# EAGLE design -ZPanel (EAGLE 9.5.1)
DESIGNER: Joshua Lungstrom; PART_NUMBER: 68-0012; PROJECT: CougSat-1: -Z Panel; REV: 1.1.1

## Sheet 1 of 3
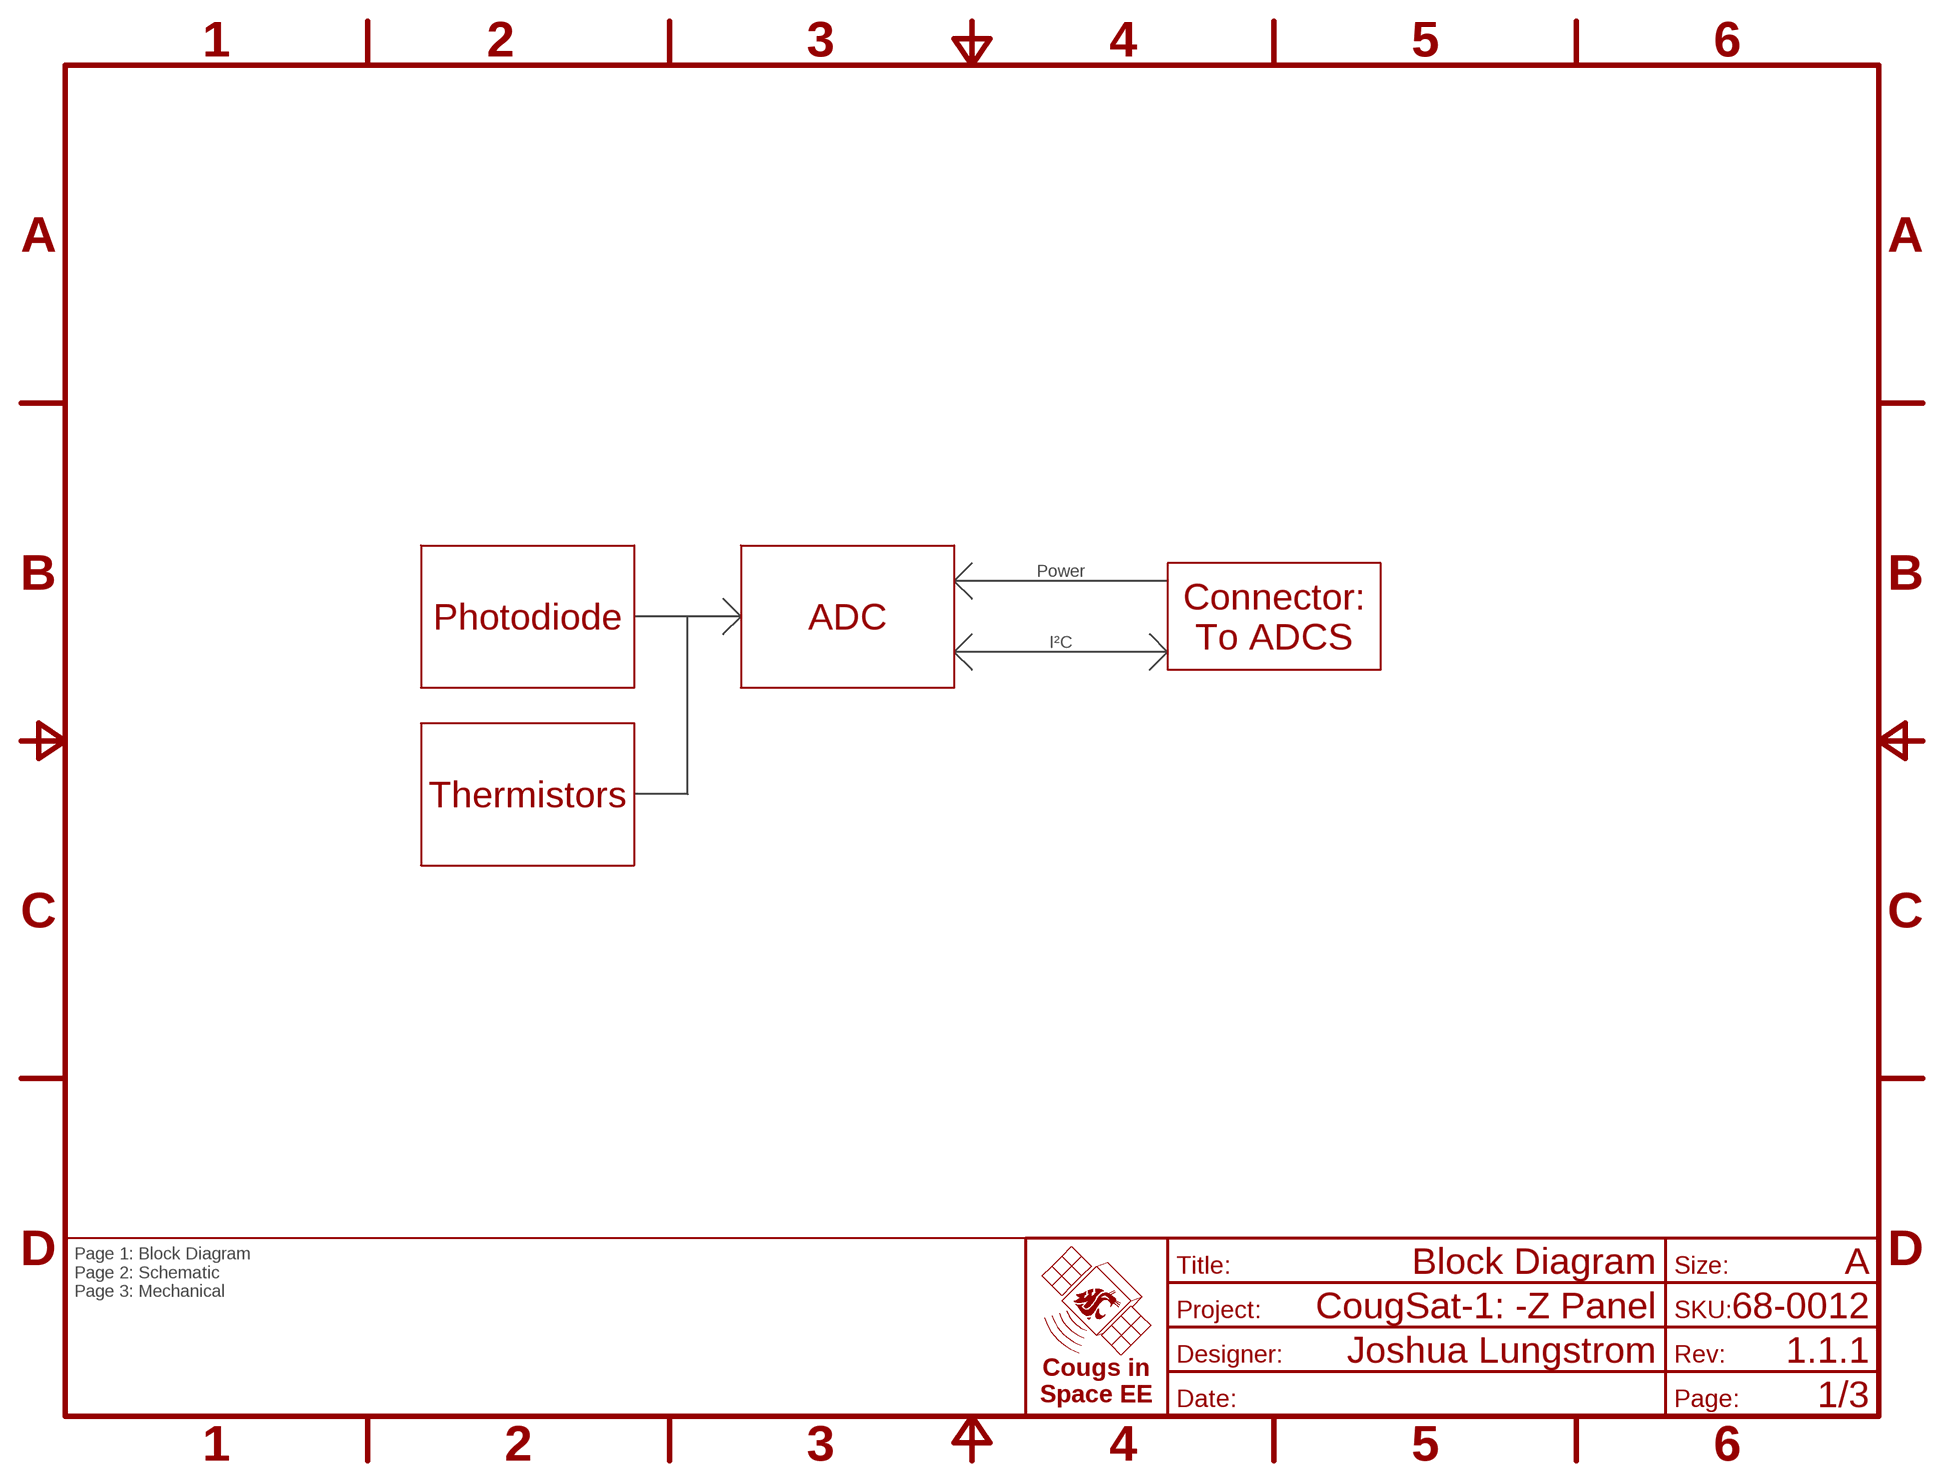
[diagram p0: schematic, sheet 1]
FRAME1 (FRAME-A): TITLE: Block Diagram

### Notes on the sheet
- Power
- Photodiode | ADC
- Connector:
  To ADCS
- I²C
- Thermistors
- Page 1: Block Diagram
  Page 2: Schematic
  Page 3: Mechanical

## Sheet 2 of 3
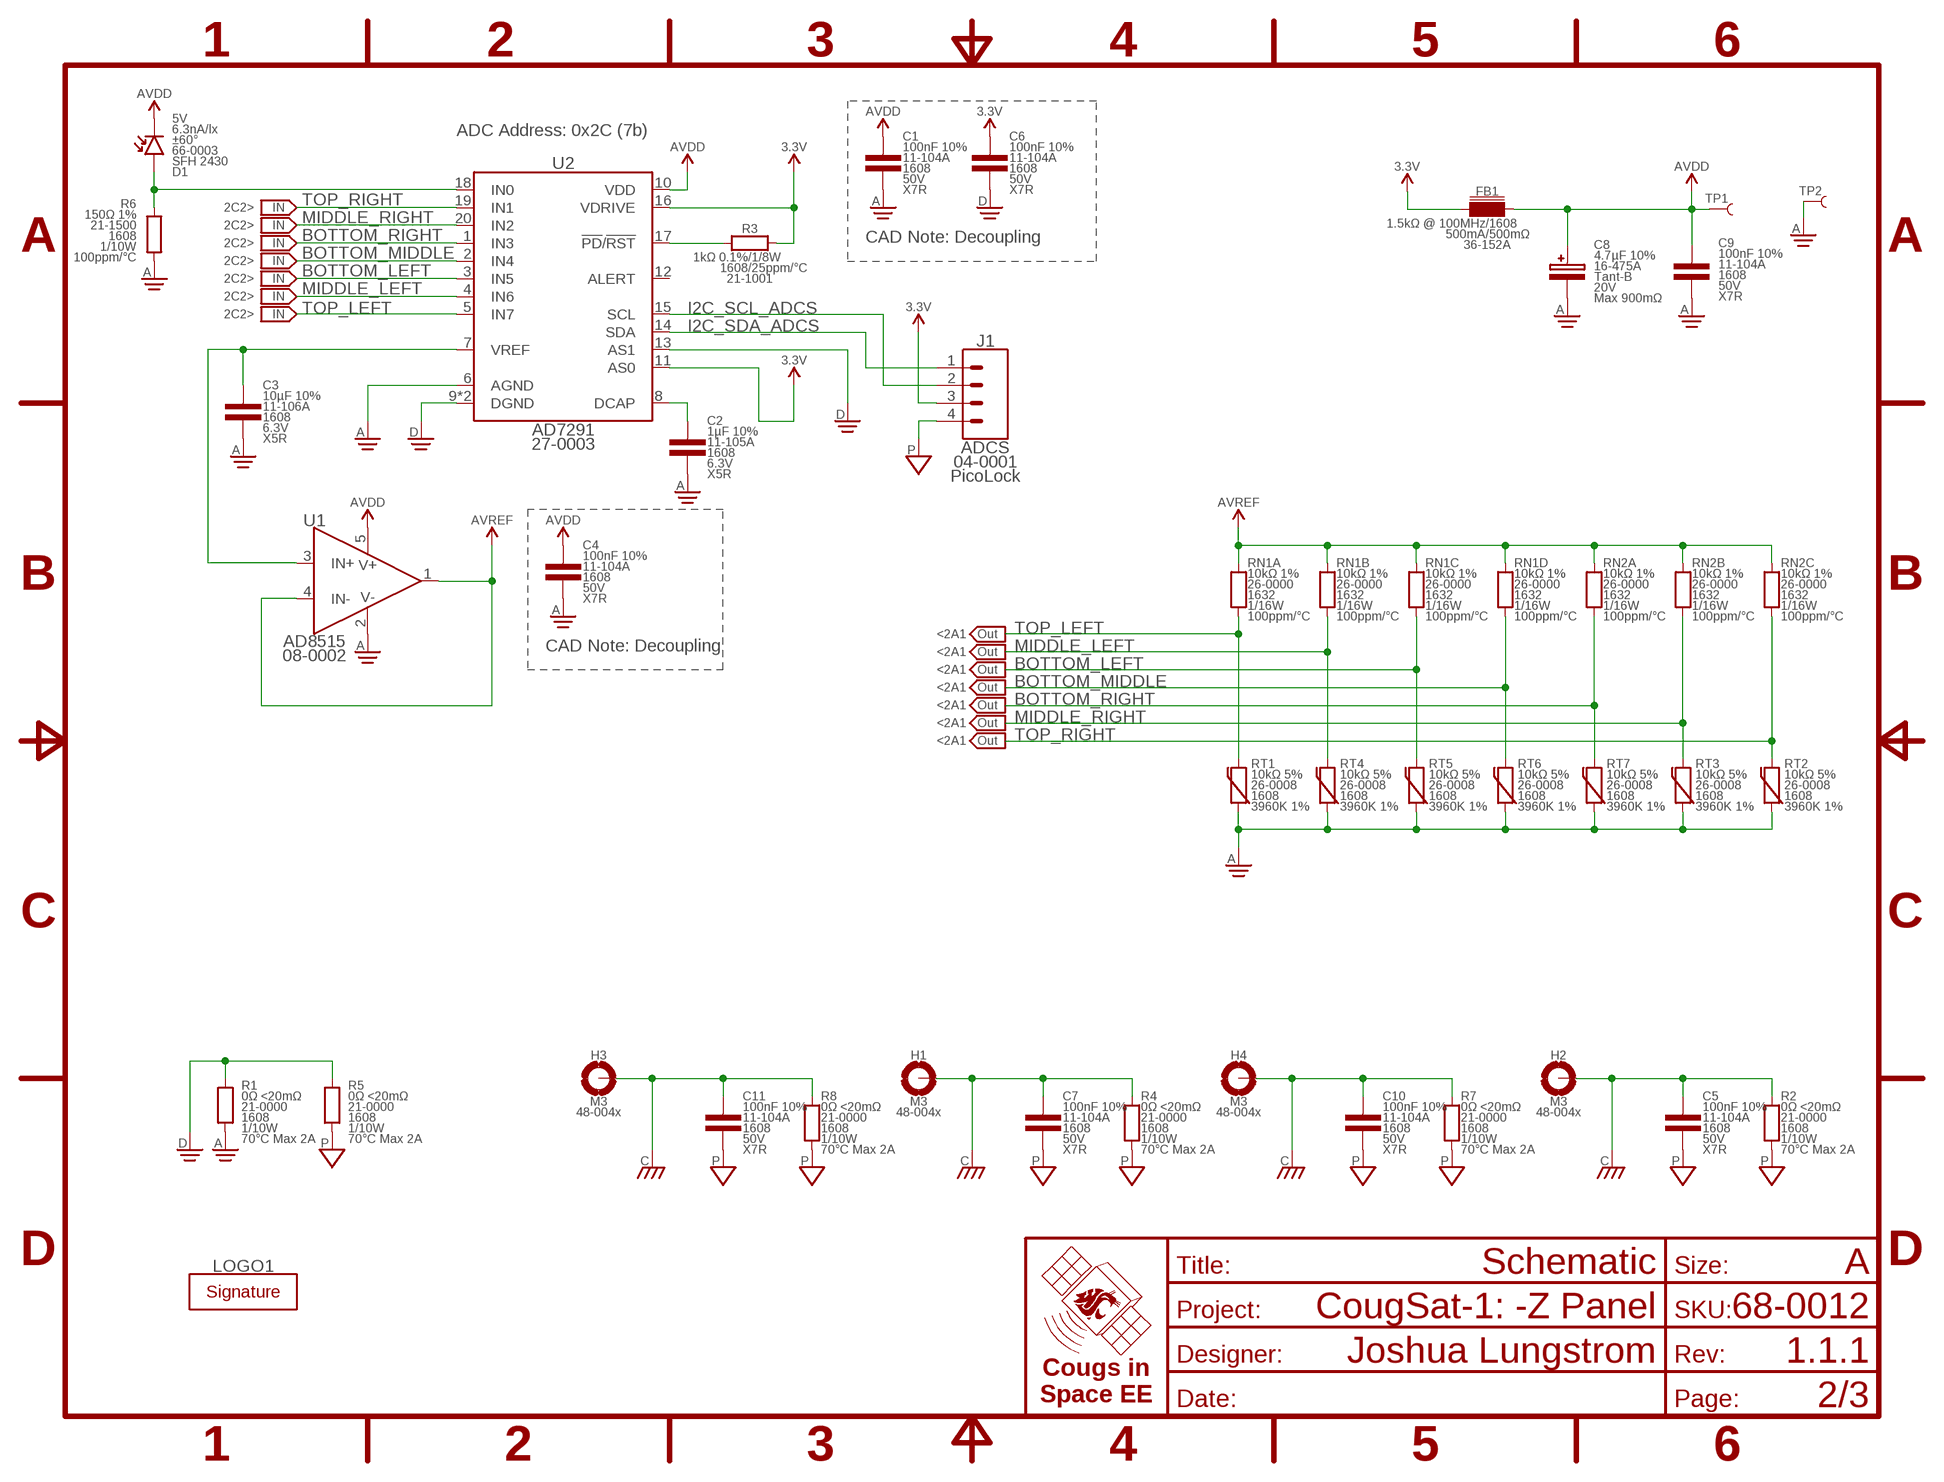
[diagram p1: schematic, sheet 2]
FRAME2 (FRAME-A): TITLE: Schematic

### Parts
C1  100nF 10%  CAP-V-100NF-1608  [1608]
C2  1µF 10%  CAP-V-1UF-1608  [1608]
C3  10µF 10%  CAP-V-10UF-1608  [1608]
C4  100nF 10%  CAP-V-100NF-1608  [1608]
C5  100nF 10%  CAP-V-100NF-1608  [1608]
C6  100nF 10%  CAP-V-100NF-1608  [1608]
C7  100nF 10%  CAP-V-100NF-1608  [1608]
C8  4.7µF 10%  CAP-POL-V-4.7UF-4028  [4028-POL]
C9  100nF 10%  CAP-V-100NF-1608  [1608]
C10  100nF 10%  CAP-V-100NF-1608  [1608]
C11  100nF 10%  CAP-V-100NF-1608  [1608]
D1  SFH 2430  PHOTODIODE-SFH2430  [SFH2430]
FB1  1.5kΩ @ 100MHz  CHOKE-H-1.5K-1608  [1608]
H1  M3  MOUNTING_HOLE-3.3  [MOUNTING_HOLE-3.3]
H2  M3  MOUNTING_HOLE-3.3  [MOUNTING_HOLE-3.3]
H3  M3  MOUNTING_HOLE-3.3  [MOUNTING_HOLE-3.3]
H4  M3  MOUNTING_HOLE-3.3  [MOUNTING_HOLE-3.3]
J1  ADCS  1X04-PICOLOCK  [PICOLOCK1.5-04]
LOGO1  SIGNATUREJOSH  [SIGN-JOSH]
R1  0Ω <20mΩ  RES-V-0-1608  [1608]
R2  0Ω <20mΩ  RES-V-0-1608  [1608]
R3  1kΩ 0.1%  RES-H-1K-1608  [1608]
R4  0Ω <20mΩ  RES-V-0-1608  [1608]
R5  0Ω <20mΩ  RES-V-0-1608  [1608]
R6  150Ω 1%  RES-V-150R-1608  [1608]
R7  0Ω <20mΩ  RES-V-0-1608  [1608]
R8  0Ω <20mΩ  RES-V-0-1608  [1608]
RN1  10kΩ 1%  RES-4-V-10K-1632  [1632]
RN2  10kΩ 1%  RES-4-V-10K-1632  [1632]
RT1  10kΩ 5%  THERMISTOR-V-10K-1608  [1608]
RT2  10kΩ 5%  THERMISTOR-V-10K-1608  [1608]
RT3  10kΩ 5%  THERMISTOR-V-10K-1608  [1608]
RT4  10kΩ 5%  THERMISTOR-V-10K-1608  [1608]
RT5  10kΩ 5%  THERMISTOR-V-10K-1608  [1608]
RT6  10kΩ 5%  THERMISTOR-V-10K-1608  [1608]
RT7  10kΩ 5%  THERMISTOR-V-10K-1608  [1608]
TP1  TEST_POINT-THT-0.7  [THT-0.7]
TP2  TEST_POINT-THT-0.7  [THT-0.7]
U1  AD8515  OPAMP-1-AD8515  [SOT23-5]
U2  AD7291  [QFN-20-4040]

### Nets
3.3V: C6.1 FB1.1 J1.3 R3.2 U2.11(AS0) U2.16(VDRIVE)
AGND: C1.2 C2.2 C3.2 C4.2 C8.C C9.2 R1.1 R6.1 RT1.1 RT2.1 RT3.1 RT4.1 RT5.1 RT6.1 RT7.1 TP2.1 U1.2(V-) U2.6(AGND)
AVDD: C1.1 C4.1 C8.A C9.1 D1.C FB1.2 TP1.1 U1.5(V+) U2.10(VDD)
AVREF: RN1.5 RN1.6 RN1.7 RN1.8 RN2.6 RN2.7 RN2.8 U1.1(OUT) U1.4(IN-)
BOTTOM_LEFT: RN1.3 RT5.2 U2.3(IN5)
BOTTOM_MIDDLE: RN1.4 RT6.2 U2.2(IN4)
BOTTOM_RIGHT: RN2.1 RT7.2 U2.1(IN3)
CHASSIS: C5.1 C7.1 C10.1 C11.1 H1.1(MOUNT) H1.V1(MOUNT) H1.V2(MOUNT) H1.V3(MOUNT) H1.V4(MOUNT) H1.V5(MOUNT) H1.V6(MOUNT) H1.V7(MOUNT) H1.V8(MOUNT) H1.V9(MOUNT) H1.V10(MOUNT) H2.1(MOUNT) H2.V1(MOUNT) H2.V2(MOUNT) H2.V3(MOUNT) H2.V4(MOUNT) H2.V5(MOUNT) H2.V6(MOUNT) H2.V7(MOUNT) H2.V8(MOUNT) H2.V9(MOUNT) H2.V10(MOUNT) H3.1(MOUNT) H3.V1(MOUNT) H3.V2(MOUNT) H3.V3(MOUNT) H3.V4(MOUNT) H3.V5(MOUNT) H3.V6(MOUNT) H3.V7(MOUNT) H3.V8(MOUNT) H3.V9(MOUNT) H3.V10(MOUNT) H4.1(MOUNT) H4.V1(MOUNT) H4.V2(MOUNT) H4.V3(MOUNT) H4.V4(MOUNT) H4.V5(MOUNT) H4.V6(MOUNT) H4.V7(MOUNT) H4.V8(MOUNT) H4.V9(MOUNT) H4.V10(MOUNT) R2.2 R4.2 R7.2 R8.2
DCAP: C2.1 U2.8(DCAP)
DGND: C6.2 R1.2 R5.2 U2.9(DGND) U2.13(AS1) U2.PAD(DGND)
I2C_SCL_ADCS: J1.2 U2.15(SCL)
I2C_SDA_ADCS: J1.1 U2.14(SDA)
MIDDLE_LEFT: RN1.2 RT4.2 U2.4(IN6)
MIDDLE_RIGHT: RN2.2 RT3.2 U2.20(IN2)
PD/RST: R3.1 U2.17(!PD!/!RST)
PGND: C5.2 C7.2 C10.2 C11.2 J1.4 R2.1 R4.1 R5.1 R7.1 R8.1
PHOTODIODE_ADC: D1.A R6.2 U2.18(IN0)
TOP_LEFT: RN1.1 RT1.2 U2.5(IN7)
TOP_RIGHT: RN2.3 RT2.2 U2.19(IN1)
VREF: C3.1 U1.3(IN+) U2.7(VREF)
Unconnected: RN2.4 RN2.5 U2.12(ALERT)

### Notes on the sheet
- ADC Address: 0x2C (7b)
- 2C2>
- 2C2>
- 2C2> | CAD Note: Decoupling
- 2C2>
- 2C2>
- 2C2>
- 2C2>
- <2A1
- CAD Note: Decoupling | <2A1
- <2A1
- <2A1
- <2A1
- <2A1
- <2A1

## Sheet 3 of 3
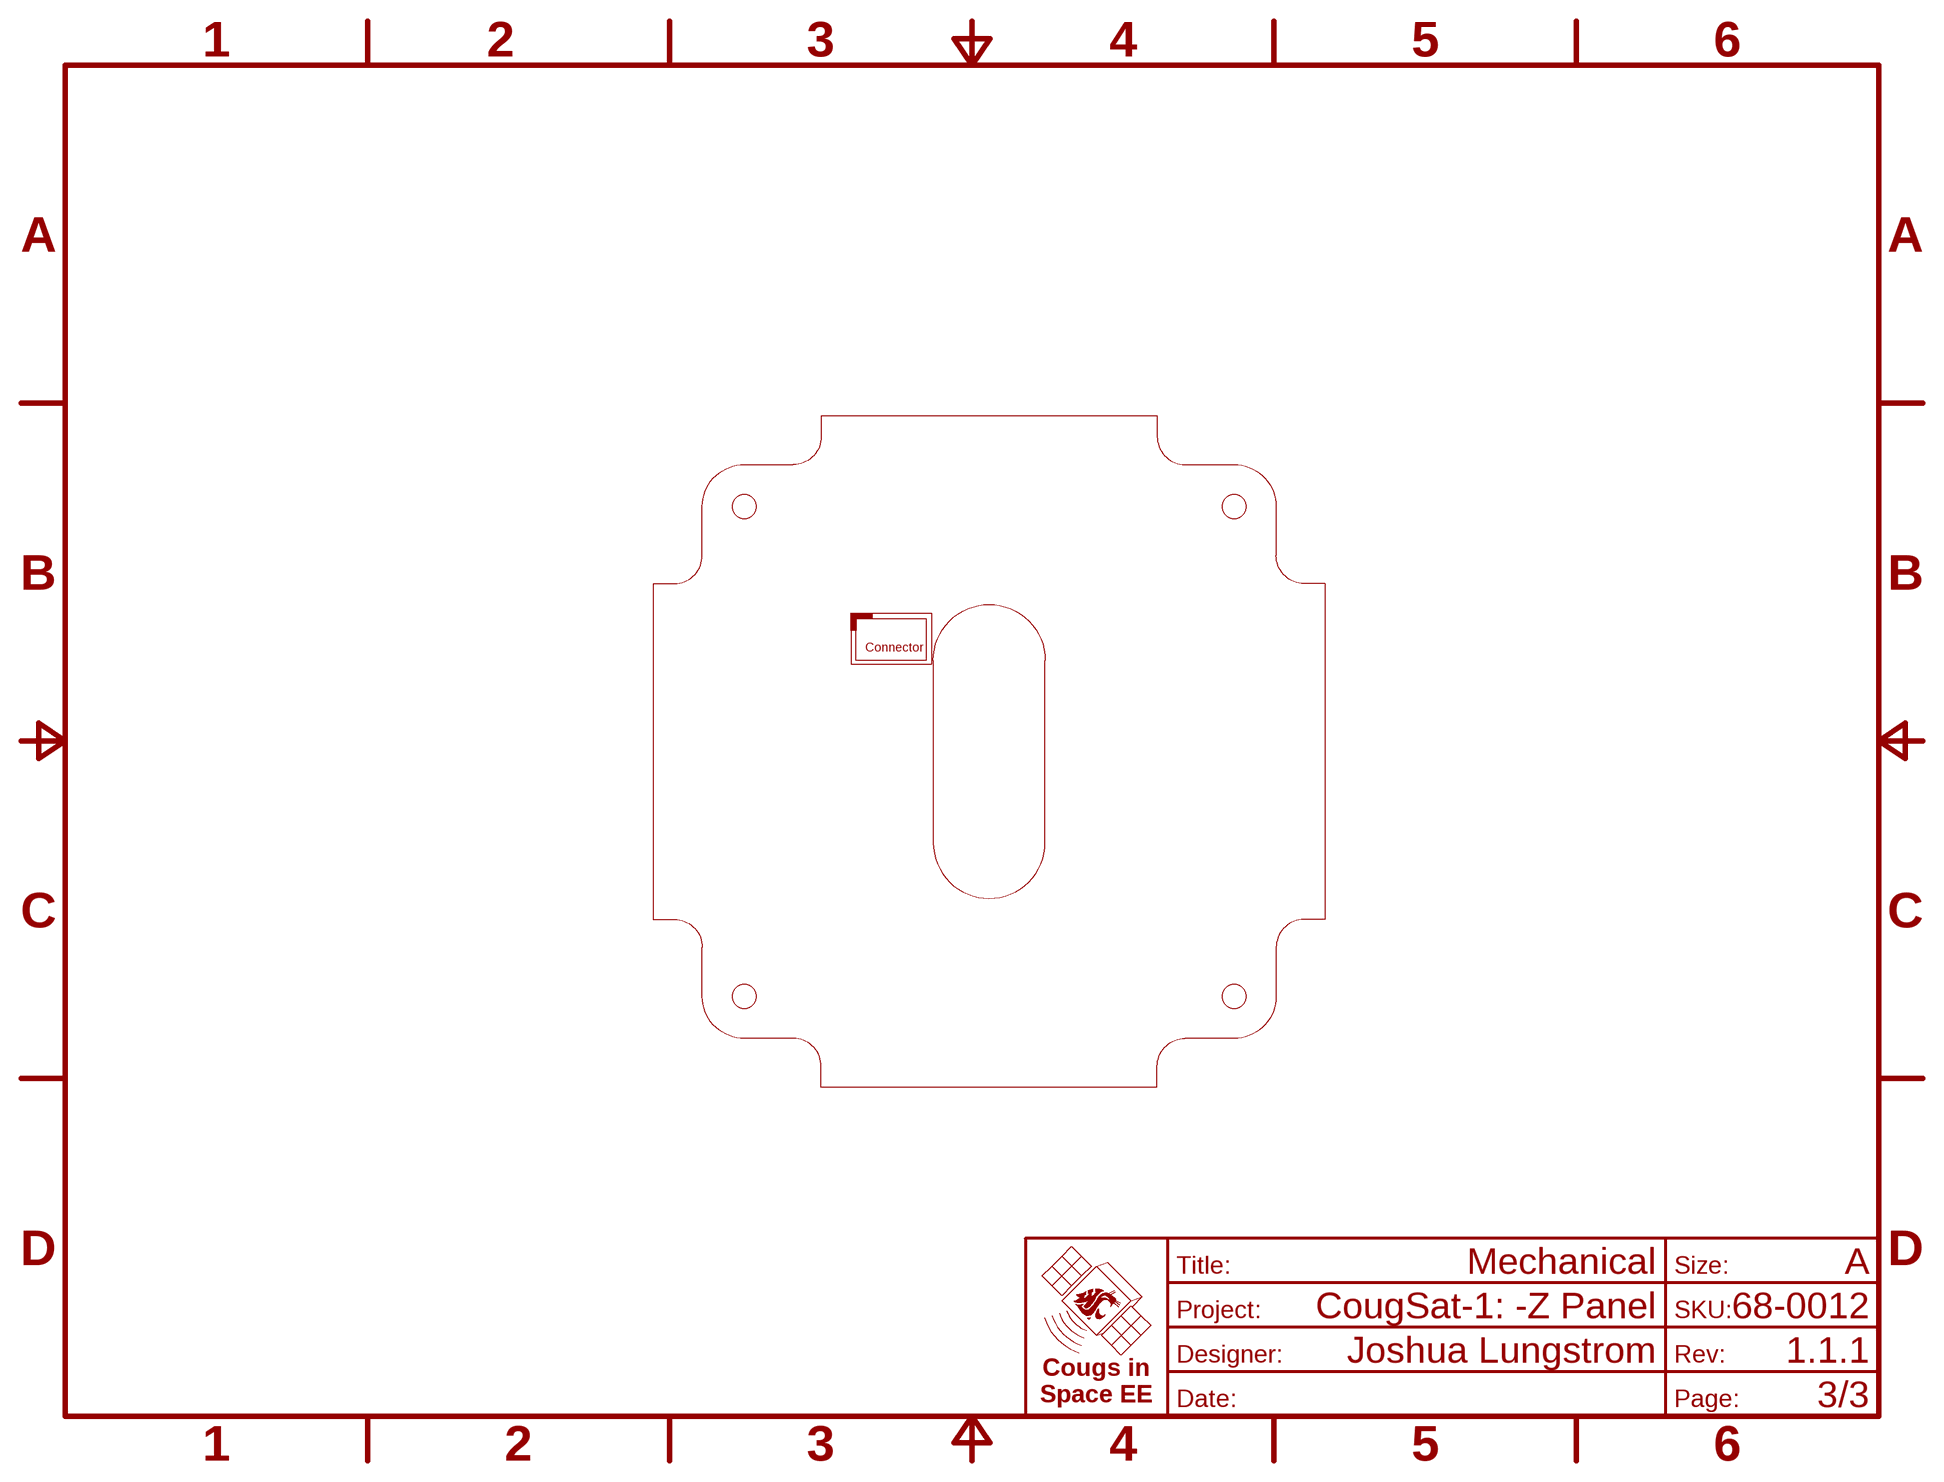
[diagram p2: schematic, sheet 3]
FRAME3 (FRAME-A): TITLE: Mechanical

### Notes on the sheet
- Connector

## Library data of the parts
C1 C4-C7 C9-C11 = CougsInSpace-Capacitors:CAP-V: Capacitor - Vertical Orientation; PACKAGE: 1608; SKU: 11-104A; TEMP: X7R; VOLTAGE: 50V
C2 = CougsInSpace-Capacitors:CAP-V: Capacitor - Vertical Orientation; PACKAGE: 1608; SKU: 11-105A; TEMP: X5R; VOLTAGE: 6.3V
C3 = CougsInSpace-Capacitors:CAP-V: Capacitor - Vertical Orientation; PACKAGE: 1608; SKU: 11-106A; TEMP: X5R; VOLTAGE: 6.3V
C8 = CougsInSpace-Capacitors:CAP-POL-V: Capacitor Polarized - Vertical Orientation; ESR: Max 900mΩ; PACKAGE: Tant-B; SKU: 16-475A; VOLTAGE: 20V
D1 = CougsInSpace-Sensors:PHOTODIODE: Photodiode; HALF_ANGLE: ±60°; SENSITIVITY: 6.3nA/lx; SKU: 66-0003; VR: 5V
FB1 = CougsInSpace-Coils:CHOKE-H: Choke (Ferrite Bead) Horizontal; CURRENT: 500mA; DCR: 500mΩ; PACKAGE: 1608; SKU: 36-152A
H1-H4 = CougsInSpace-Hardware:MOUNTING_HOLE: Mounting Hole; SKU: 48-004x
J1 = CougsInSpace-Connectors:1X04: Generic Connector - 4 Conductor; PACKAGE: PicoLock; SKU: 04-0001
LOGO1 = CougsInSpace-Aesthetics:SIGNATURE: Designer's (Artist's) Signature
R1 R2 R4 R5 R7 R8 = CougsInSpace-Resistors:RES-V: Resistor Vertical; PACKAGE: 1608; POWER: 1/10W; SKU: 21-0000; TEMP: 70°C Max 2A
R3 = CougsInSpace-Resistors:RES-H: Resistor Horizontal; PACKAGE: 1608; POWER: 1/8W; SKU: 21-1001; TEMP: 25ppm/°C
R6 = CougsInSpace-Resistors:RES-V: Resistor Vertical; PACKAGE: 1608; POWER: 1/10W; SKU: 21-1500; TEMP: 100ppm/°C
RN1 RN2 = CougsInSpace-Resistors:RES-4-V: Resistor Array - 4 - Vertical; PACKAGE: 1632; POWER: 1/16W; SKU: 26-0000; TEMP: 100ppm/°C
RT1-RT7 = CougsInSpace-Resistors:THERMISTOR-V: Thermistor Vertical; B2585: 3960K 1%; PACKAGE: 1608; SKU: 26-0008
TP1 TP2 = CougsInSpace-Connectors:TEST_POINT: Test Point Used to probe points in a circuit for debugging or general measurement
U1 = CougsInSpace-IC-Amplifiers:OPAMP-1: Operational Amplifier - Single; SKU: 08-0002
U2 = CougsInSpace-IC-Conversion:AD7291: AD7291 12b ADC with 8-single ended channels. I²C interface; SKU: 27-0003

## Net classes
1 RF: clearance 1.65 mm

## Board
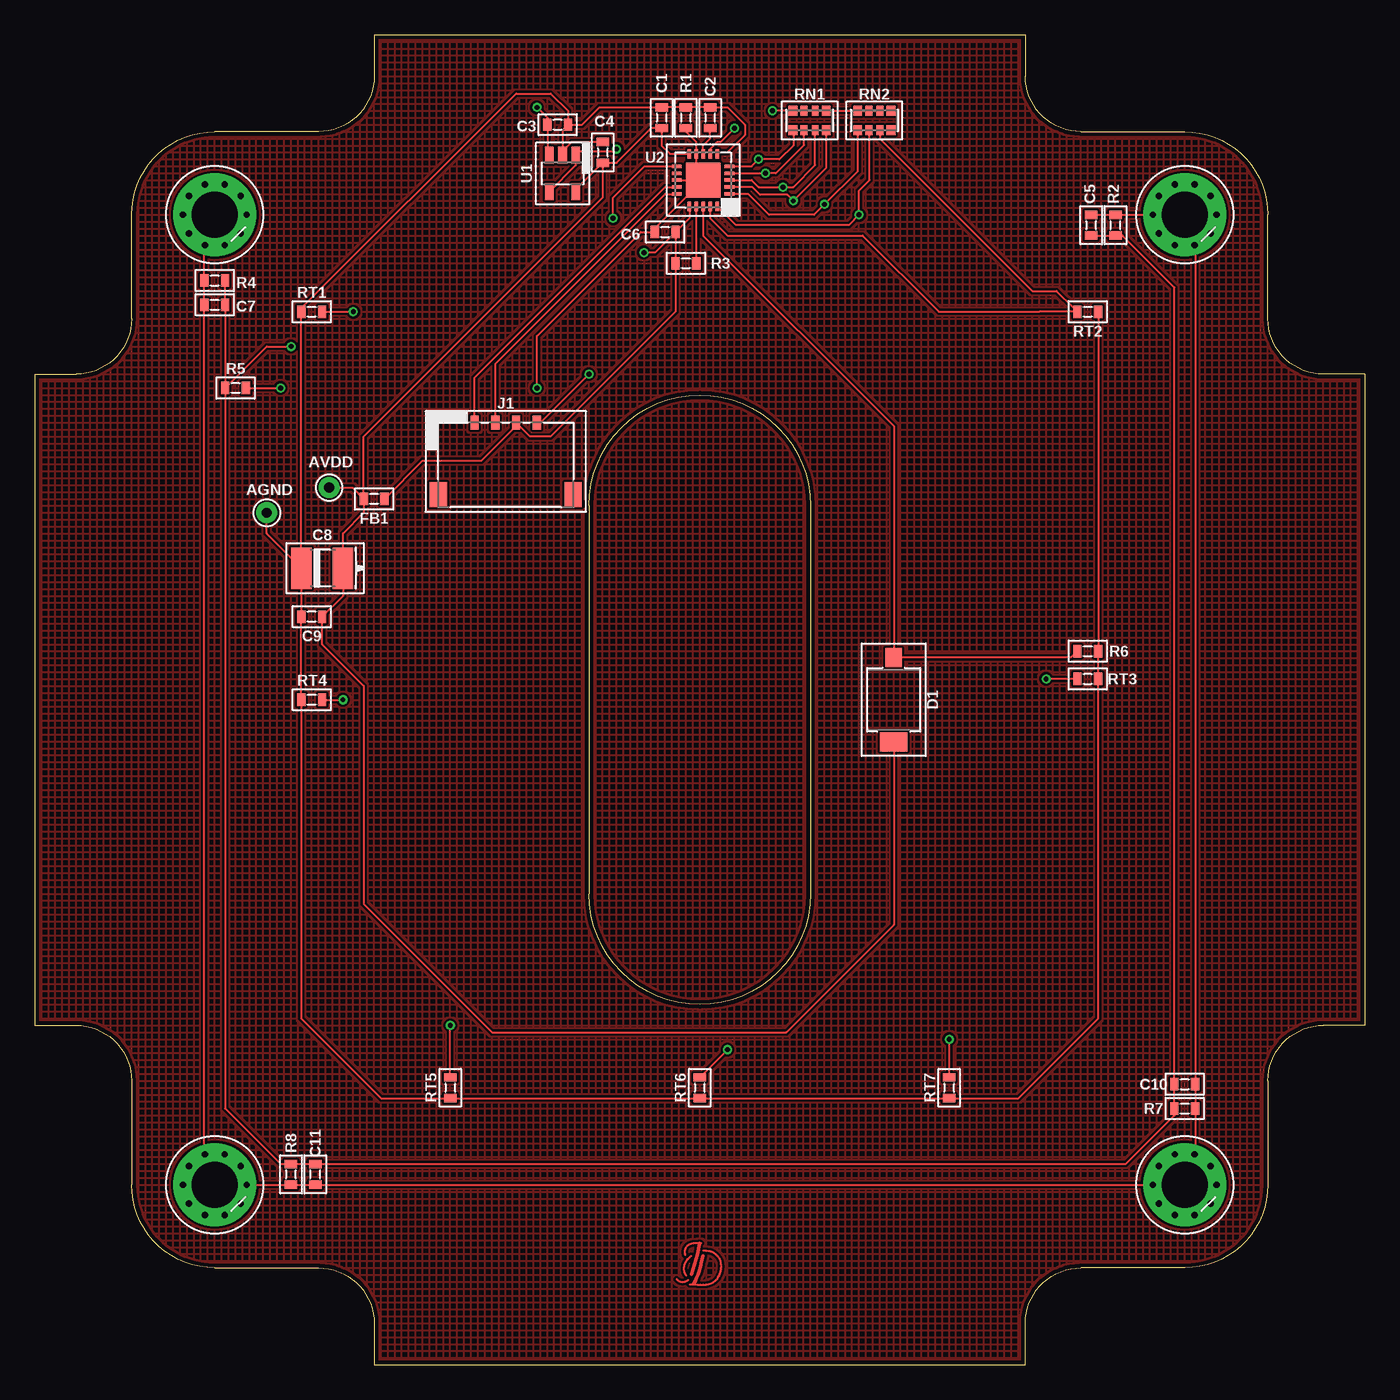
[diagram p3: board, top side]
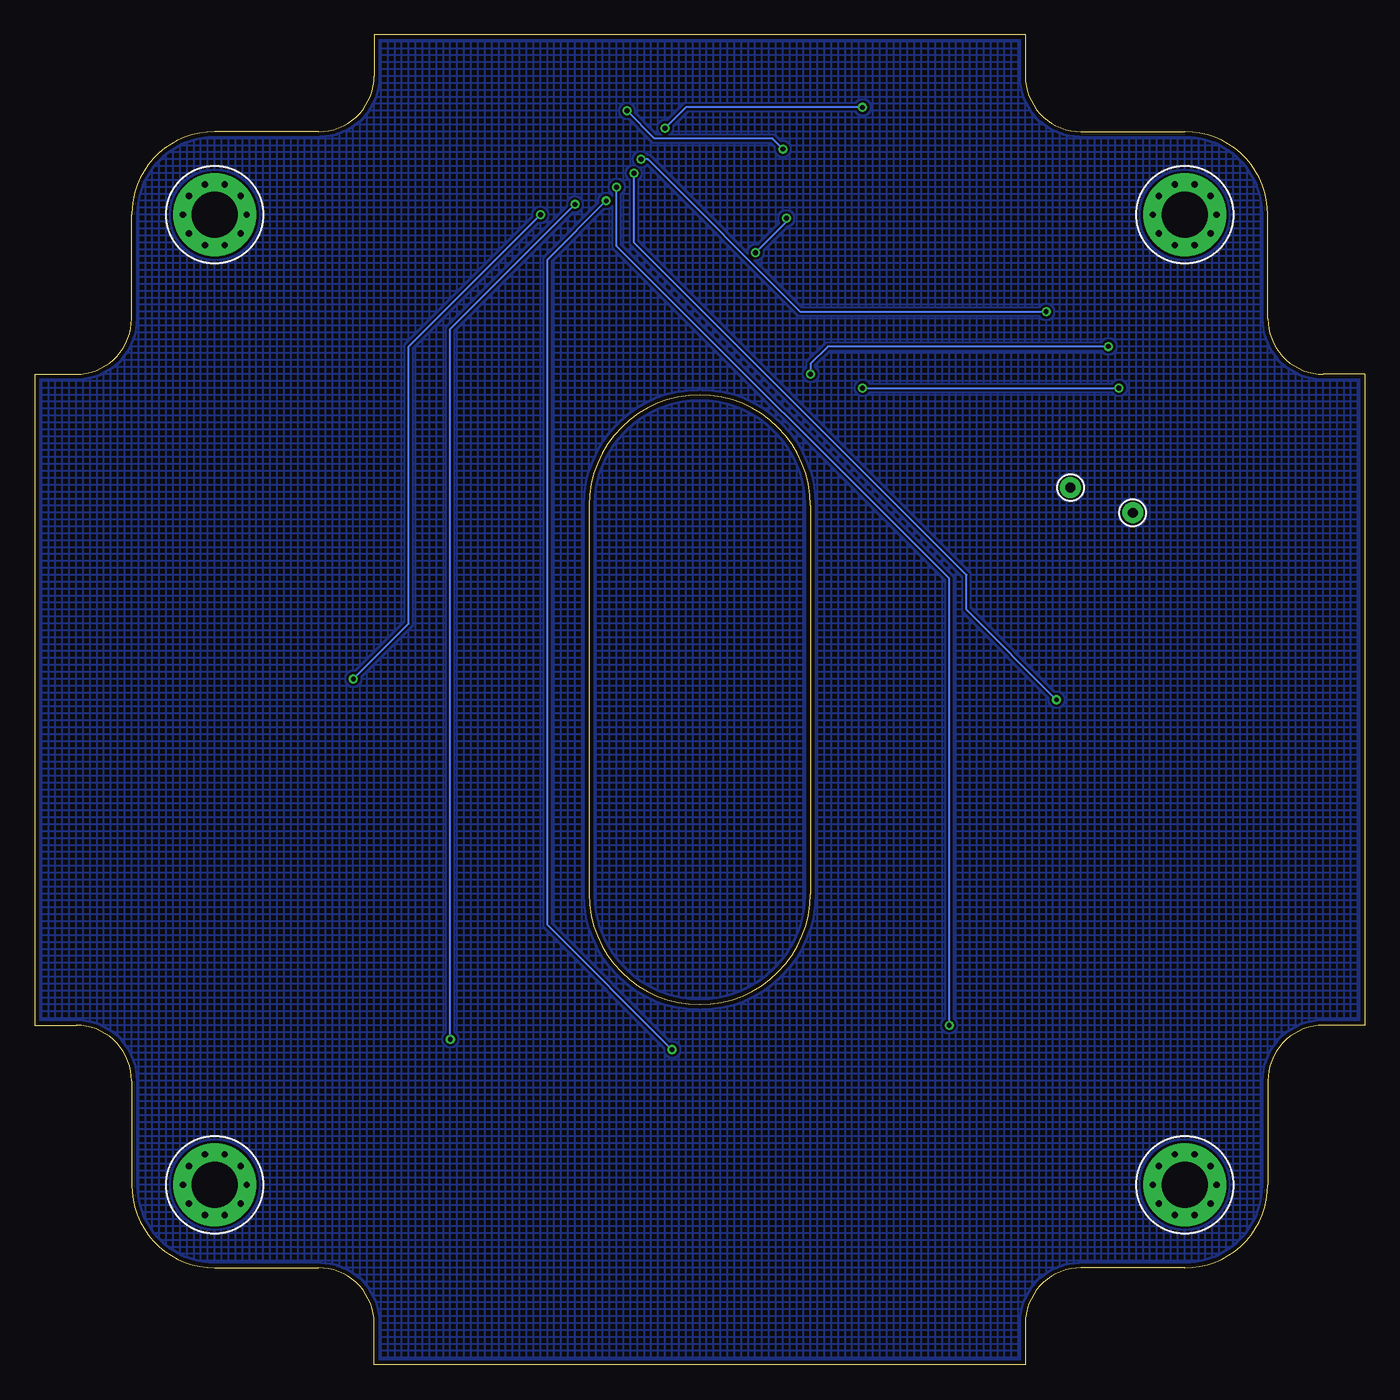
[diagram p4: board, bottom side, seen from below]

Size 96 x 96 mm. Coordinates in mm from the lower left corner, seen from the top.
Outline: 24.5,0 24.75,0
Outline: 24.75,0 71.5,0 71.5,3 arc-90 75.5,7 83,7 arc90 89,13 89,20.5 arc-90 93,24.5 96,24.5 96,71.5 93,71.5 arc-90 89,75.5 89,83 arc90 83,89 75.5,89 arc-90 71.5,93 71.5,96 24.5,96 24.5,93 arc-90 20.5,89 13,89 arc90 7,83 7,75.5 arc-90 3,71.5 0,71.5 0,24.5 3,24.5 arc-90 7,20.5 7,13 arc90 13,7 20.5,7 arc-90 24.5,3 24.5,0
Outline: 24.5,0 24.75,0
Outline: 56,62 56,34 arc-180 40,34 40,62 arc-180 56,62
Copper layers (1*16): Top 0.035mm / dielectric 1.6mm / Bottom 0.035mm
Design rules "CougsInSpace": minimum track width 0.16mm, minimum drill 0.3mm, track to track 0.16mm, track to pad 0.16mm, pad to pad 0.16mm, via to via 0.16mm, smd to smd 0mil, copper to edge 0.3mm, drill to drill 0.3mm, minimum pad ring 0.15mm, minimum via ring 0.15mm, stop-mask expansion 0mil, vias tented up to drill 1mm, thermal gap 0.25mm

### Footprints (pad centres in the part's own frame; a part is rotated, then mirrored left to right if it is on the bottom)
1608 = smd 0.6 x 0.9: 1 -0.75,0; 2 0.75,0
4028-POL = smd 1.5 x 3: A 1.5,0; C -1.5,0
SFH2430 = smd 1.4 x 1.2: A -3.05,0 | smd 1.4 x 2: C 3.05,0
MOUNTING_HOLE-3.3 = drill 3.3 pad 6: 1 0,0 | drill 0.45 pad 0.6: V1 2.3,0; V2 1.861,1.352; V3 0.711,2.187; V4 -0.711,2.187; V5 -1.861,1.352; V6 -2.3,0; V7 -1.861,-1.352; V8 -0.711,-2.187; V9 0.711,-2.187; V10 1.861,-1.352
PICOLOCK1.5-04 = smd 0.6 x 1: 1 2.25,0; 2 0.75,0; 3 -0.75,0; 4 -2.25,0 | smd 1.25 x 1.8: PAD@1 4.855,5.2; PAD@2 -4.855,5.2
1632 = smd 0.64 x 0.7: 1 -1.2,-0.7; 4 1.2,-0.7; 5 1.2,0.7; 8 -1.2,0.7 | smd 0.5 x 0.7: 2 -0.4,-0.7; 3 0.4,-0.7; 6 0.4,0.7; 7 -0.4,0.7
THT-0.7 = drill 0.7 pad 1.5: 1 0,0
SOT23-5 = smd 1.22 x 0.62: 1 -1.31,0.95; 2 -1.31,0; 3 -1.31,-0.95; 4 1.31,-0.95; 5 1.31,0.95
QFN-20-4040 = smd 0.7 x 0.25: 1 -1.9,1; 2 -1.9,0.5; 3 -1.9,0; 4 -1.9,-0.5; 5 -1.9,-1; 11 1.9,-1; 12 1.9,-0.5; 13 1.9,0; 14 1.9,0.5; 15 1.9,1 | smd 0.25 x 0.7: 6 -1,-1.9; 7 -0.5,-1.9; 8 0,-1.9; 9 0.5,-1.9; 10 1,-1.9; 16 1,1.9; 17 0.5,1.9; 18 0,1.9; 19 -0.5,1.9; 20 -1,1.9 | smd 2.5 x 2.5: PAD 0,0

### Placement (x,y rotation side)
C1  45.25,90 90 top
C2  48.75,90 90 top
C3  37.75,89.5 0 top
C4  41,87.5 90 top
C5  76.25,82.25 270 top
C6  45.5,81.75 180 top
C7  13,76.5 0 top
C8  20.75,57.5 0 top
C9  20,54 180 top
C10  83,20.25 180 top
C11  20.25,13.75 90 top
D1  62,48 270 top
FB1  24.5,62.5 180 top
H1  13,83 0 top
H2  83,83 0 top
H3  13,13 0 top
H4  83,13 0 top
J1  34,68 180 top
LOGO1  48,7 0 top
R1  47,90 270 top
R2  78,82.25 90 top
R3  47,79.5 180 top
R4  13,78.25 180 top
R5  14.5,70.5 0 top
R6  76,51.5 180 top
R7  83,18.5 0 top
R8  18.5,13.75 270 top
RN1  55.93,89.81 0 top
RN2  60.6,89.81 0 top
RT1  20,76 0 top
RT2  76,76 180 top
RT3  76,49.5 180 top
RT4  20,48 0 top
RT5  30,20 90 top
RT6  48,20 90 top
RT7  66,20 90 top
TP1  21.25,63.31 0 top
TP2  16.75,61.5 0 top
U1  38.1,85.98 270 top
U2  48.25,85.5 180 top

### Tracks (layer width: path | path; a pad name or v marks a point on that pad's centre or on a via)
3.3V  (via drill 0.35)
  Top 0.16: FB1.1 28,65.25 32.25,65.25 34.75,67.75 J1.3 35.75,67 37.25,67 46.25,76 R3.2 C6.1 | U2.16 47.25,82.75 C6.1 | U2.11 44,86.5 41.75,84.25 v41.75,82.75 | C6.1 44.77,80.28 v43.98,80.28
  Bottom 0.16: v43.98,80.28 41.75,82.5 v41.75,82.75
AGND
  Top 0.16: C8.C C9.2 RT4.1 19.25,25 25,19.25 RT5.1 RT6.1 RT7.1 71,19.25 76.75,25 RT3.1 R6.1 RT2.1 | U2.6 49.35,87.5 50,87.5 51.25,88.75 51.25,89.5 50,90.75 C2.2 R1.1 C1.2 40.75,90.75 39.5,89.5 C3.2 | C8.C RT1.1 19.25,76.25 34.75,91.75 37.25,91.75 38.5,90.5 C3.2 | C4.2 38.75,88.25 38.1,87.6 | 38.1,87.6 U1.2 | C3.2 38.1,89.1 38.1,87.6 | C8.C 16.75,60 TP2.1
AVDD
  Top 0.16: TP1.1 22.94,63.31 FB1.2 | FB1.2 23.75,61.5 22.25,60 C8.A 22.25,55.5 C9.1 20.75,52 23.75,49 23.75,33.25 33,24 54.25,24 62,31.75 D1.C | FB1.2 23.75,67 41,84.25 C4.1 | U2.10 45.85,87.4 45.25,88 C1.1 44.5,89.25 42,86.75 C4.1 | U1.5 39.05,84.8 C4.1
AVREF  (via drill 0.35)
  Top 0.16: U1.4 39.05,86.57 U1.1 39.3,87.54 41.79,87.54 v42,87.75 | RN2.6 RN2.7 RN2.8 RN1.5 RN1.6 RN1.7 RN1.8 v53.25,90.5
  Bottom 0.16: v42,87.75 42.75,88.5 51.25,88.5 v53.25,90.5
BOTTOM_LEFT  (via drill 0.35)
  Top 0.16: RT5.2 v30,24.5 | U2.3 51.75,85.5 52.25,85 v54,85 54.75,85 56.33,86.58 RN1.3
  Bottom 0.16: v30,24.5 30,56.75 54,80.75 v54,85
BOTTOM_MIDDLE  (via drill 0.35)
  Top 0.16: RT6.2 v50,22.75 | U2.2 51.8,85 52.36,84.44 54.31,84.44 v54.75,84 57.13,86.38 RN1.4
  Bottom 0.16: v50,22.75 59,31.75 59,79.75 v54.75,84
BOTTOM_RIGHT  (via drill 0.35)
  Top 0.16: RT7.2 v66,23.5 | U2.1 51.5,84.5 53,83 56.25,83 v57,83.75 59.4,86.15 RN2.1
  Bottom 0.16: v66,23.5 66,74.75 v57,83.75
CHASSIS
  Top 0.16: H3.1 12.29,13.71 H3.V4 | H3.1 13,14.48 H3.V3 | H3.1 14.35,14.35 H3.V2 | H3.1 H3.V1 | H3.1 13.51,13 H3.V10 | H3.1 13.71,12.29 H3.V9 | H3.1 13,11.52 H3.V8 | H3.1 11.65,11.65 H3.V7 | H3.1 H3.V6 | H3.1 11.65,14.35 H3.V5 | H4.V2 84.35,14.35 H4.1 | H4.1 H4.V1 | H4.1 83.51,13 H4.V10 | H4.V9 83.71,12.29 H4.1 | H4.1 83,11.52 H4.V8 | H4.1 81.65,11.65 H4.V7 | H4.1 H4.V6 C11.1 R8.2 H3.1 | H4.1 82.49,13 H4.V5 | H4.V4 82.29,13.71 H4.1 | H2.1 83.71,82.29 H2.V9 | H2.1 83,81.52 H2.V8 | H2.1 81.65,81.65 H2.V7 | H2.1 H2.V6 R2.2 C5.1 | H2.1 82.49,83 H2.V5 | H2.1 82.29,83.71 H2.V4 | H2.1 83,84.48 H2.V3 | H2.1 84.35,84.35 H2.V2 | H2.1 H2.V1 | H2.1 84.35,81.65 H2.V10 | 13,84.48 H1.V3 | H1.1 13,84.48 | 13,84.48 H1.V4 | H1.1 11.65,84.35 H1.V5 | H1.1 H1.V6 | H1.1 11.65,81.65 H1.V7 | H1.1 12.29,82.29 12.29,81 | 12.29,81 H1.V8 | H1.1 13,81.52 H1.V9 | H1.1 14.35,84.35 H1.V2 | H1.1 13.51,83 H1.V10 | H1.1 H1.V1 | H3.1 12.25,13.75 C7.1 R4.2 12.25,80.96 12.29,81 | H2.1 83.75,82.25 C10.1 R7.2 83.75,15.23 H4.V3 83,14.48 H4.1
DCAP
  Top 0.16: U2.8 48.25,88 48.75,88.5 C2.1
DGND  (via drill 0.35)
  Top 0.16: R1.2 47,89 47.75,88.25 U2.9 47.75,86 U2.PAD | U2.13 U2.PAD | R5.2 v17.75,70.5 | U2.PAD 44.75,82 C6.2 43.75,81.75 36.25,74.25 v36.25,70.5
  Bottom 0.16: v36.25,70.5 v17.75,70.5
HATCH
  pour Top (hatched): 0,24.5 3,24.5 arc-90 7,20.5 7,13 arc90 13,7 20.5,7 arc-90 24.5,3 24.5,0 71.5,0 71.5,3 arc-90 75.5,7 83,7 arc90 89,13 89,20.5 arc-90 93,24.5 96,24.5 96,71.5 93,71.5 arc-90 89,75.5 89,83 arc90 83,89 75.5,89 arc-90 71.5,93 71.5,96 24.5,96 24.5,93 arc-90 20.5,89 13,89 arc90 7,83 7,75.5 arc-90 3,71.5 0,71.5
HATCH1
  pour Bottom (hatched): 0,24.5 3,24.5 arc-90 7,20.5 7,13 arc90 13,7 20.5,7 arc-90 24.5,3 24.5,0 71.5,0 71.5,3 arc-90 75.5,7 83,7 arc90 89,13 89,20.5 arc-90 93,24.5 96,24.5 96,71.5 93,71.5 arc-90 89,75.5 89,83 arc90 83,89 75.5,89 arc-90 71.5,93 71.5,96 24.5,96 24.5,93 arc-90 20.5,89 13,89 arc90 7,83 7,75.5 arc-90 3,71.5 0,71.5
I2C_SCL_ADCS
  Top 0.16: J1.2 33.25,72.25 45.5,84.5 U2.15
I2C_SDA_ADCS
  Top 0.16: J1.1 31.75,71.25 45.5,85 U2.14
MIDDLE_LEFT  (via drill 0.35)
  Top 0.16: RT4.2 v22.25,48 | U2.4 v52.75,86 53.5,86 55.53,88.03 RN1.2
  Bottom 0.16: v22.25,48 28.75,54.5 28.75,57 52.75,81 v52.75,86
MIDDLE_RIGHT  (via drill 0.35)
  Top 0.16: RT3.2 v73,49.5 | U2.20 50.6,82.25 58.75,82.25 v59.5,83 59.5,84.75 60.25,85.5 60.25,89.06 RN2.2
  Bottom 0.16: v73,49.5 69,53.5 69,73.5 v59.5,83
PD/RST
  Top 0.16: R3.1 U2.17
PGND  (via drill 0.35)
  Top 0.16: C5.2 R2.1 78.5,81.5 82.25,77.75 C10.2 R7.1 82.25,18 78.75,14.5 C11.2 R8.1 17.75,14.5 13.75,18.5 R5.1 | R5.1 C7.2 R4.1 | R5.1 16.75,73.5 v18.5,73.5 | v40,71.5 36.5,68 J1.4
  Bottom 0.16: v18.5,73.5 38.75,73.5 40,72.25 v40,71.5
PHOTODIODE_ADC
  Top 0.16: U2.18 48.25,81.5 62,67.75 D1.A 74.8,51.05 R6.2
TOP_LEFT  (via drill 0.35)
  Top 0.16: RT1.2 v23,76 | U2.5 51.75,86.5 v52.25,87 53.75,87 54.75,88 54.75,89.09 RN1.1
  Bottom 0.16: v23,76 40.75,76 51.75,87 v52.25,87
TOP_RIGHT
  Top 0.16: RT2.2 75,76 | 75,76 72.5,76 65.25,76 59.75,81.5 50,81.5 48.75,82.75 U2.19 | RN2.3 61,88.5 72,77.5 73.75,77.5 75,76.25 75,76
VREF  (via drill 0.35)
  Top 0.16: U1.3 37,87.29 C3.1 37,90 v36.25,90.75 | U2.7 48.75,87.75 49.25,88.25 49.5,88.25 v50.5,89.25
  Bottom 0.16: v36.25,90.75 49,90.75 v50.5,89.25

### Text on the board
tNames: AVDD | AGND